# EAGLE design stereomix-front (EAGLE 9.0.1)
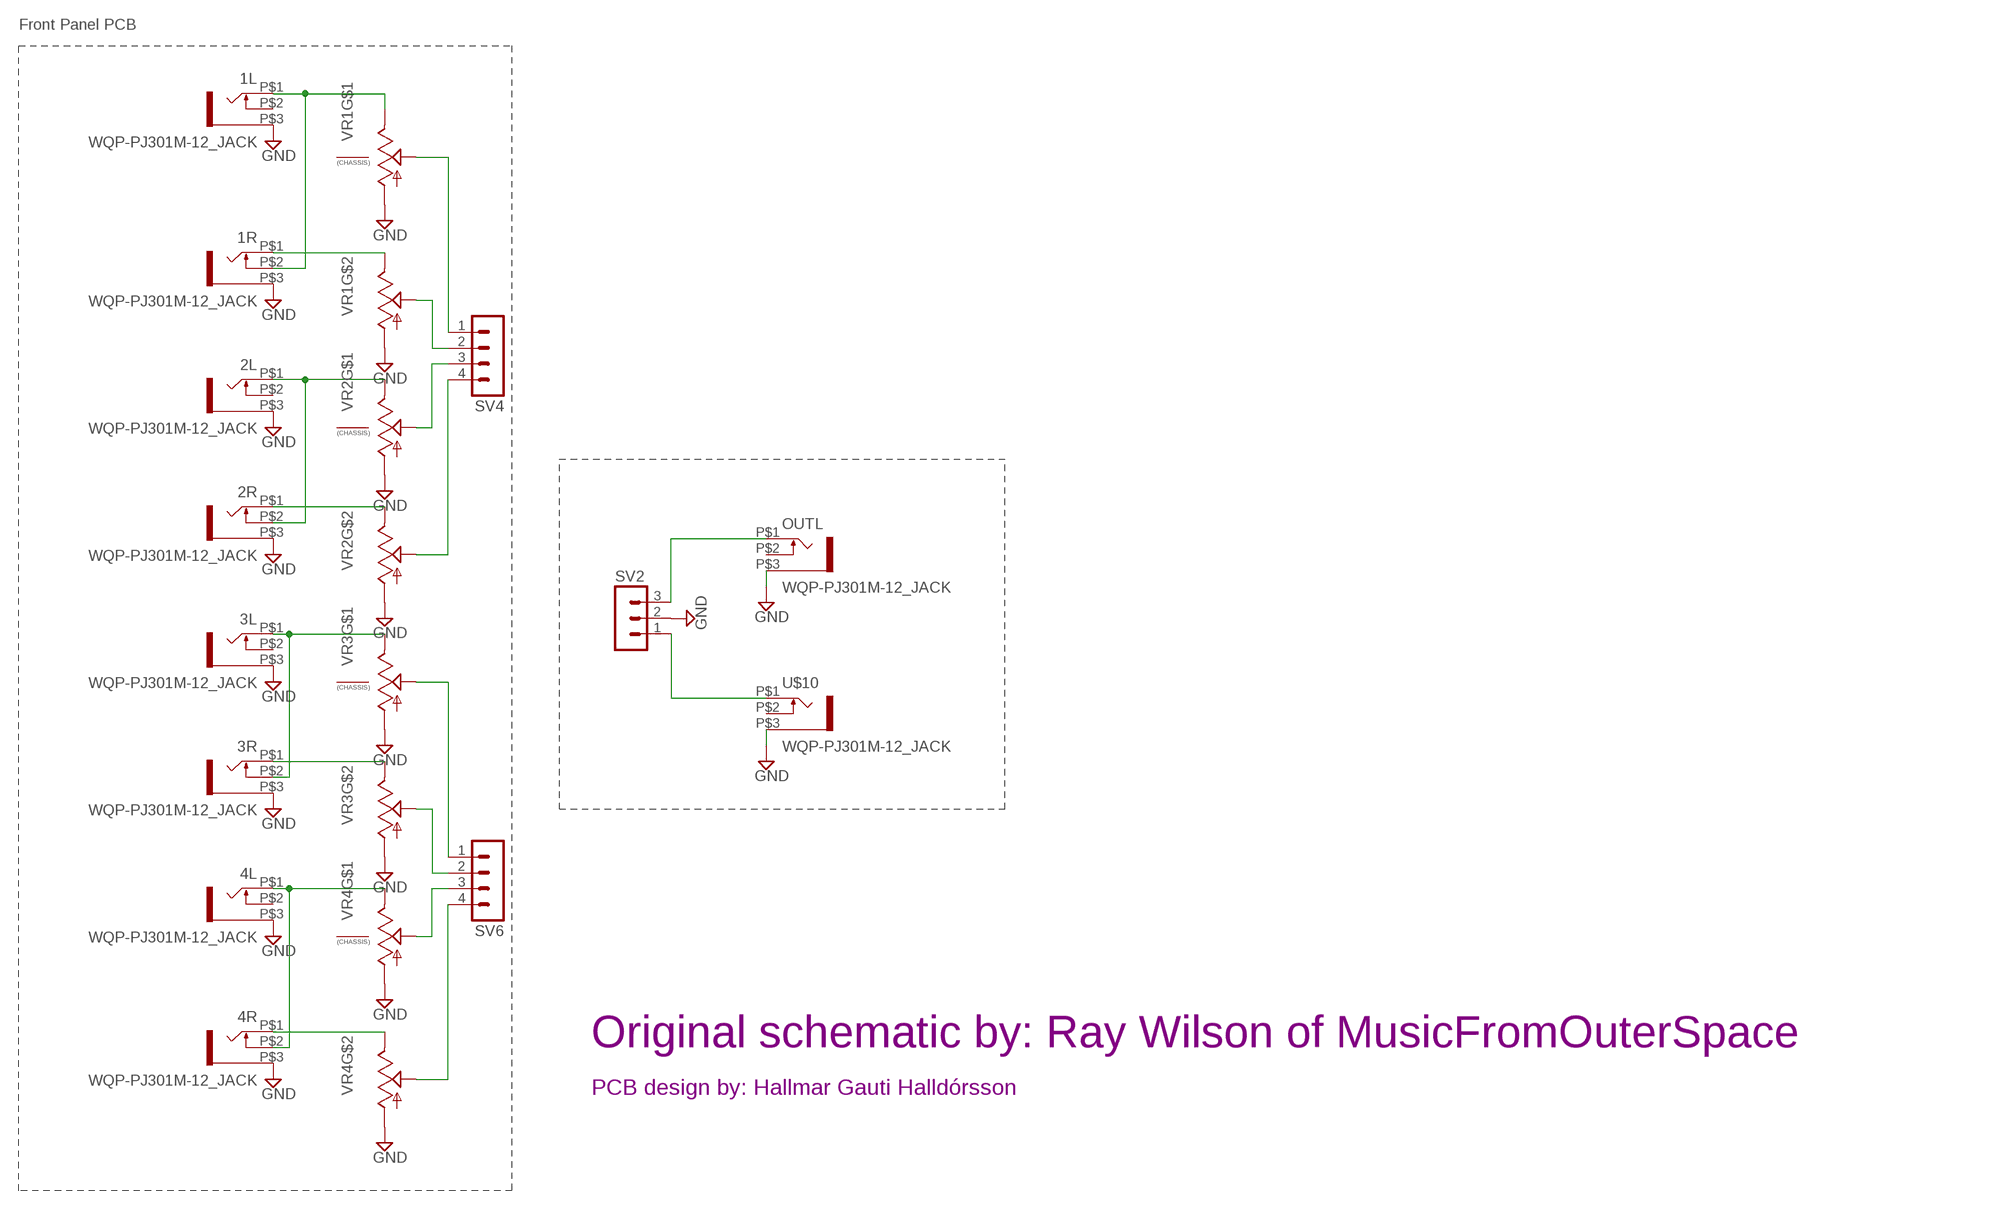
[diagram p0: schematic, sheet 1]

## Parts
1L  WQP-PJ301M-12_JACK  [WQP-PJ301M-12_JACK]
1R  WQP-PJ301M-12_JACK  [WQP-PJ301M-12_JACK]
2L  WQP-PJ301M-12_JACK  [WQP-PJ301M-12_JACK]
2R  WQP-PJ301M-12_JACK  [WQP-PJ301M-12_JACK]
3L  WQP-PJ301M-12_JACK  [WQP-PJ301M-12_JACK]
3R  WQP-PJ301M-12_JACK  [WQP-PJ301M-12_JACK]
4L  WQP-PJ301M-12_JACK  [WQP-PJ301M-12_JACK]
4R  WQP-PJ301M-12_JACK  [WQP-PJ301M-12_JACK]
OUTL  WQP-PJ301M-12_JACK  [WQP-PJ301M-12_JACK]
SV2  MA03-1  [MA03-1]
SV4  MA04-1  [MA04-1]
SV6  MA04-1  [MA04-1]
U$10  WQP-PJ301M-12_JACK  [WQP-PJ301M-12_JACK]
VR1  ALPHA-9MM-DUALPOT  [DUAL_9MM_SNAP-IN_POT]
VR2  ALPHA-9MM-DUALPOT  [DUAL_9MM_SNAP-IN_POT]
VR3  ALPHA-9MM-DUALPOT  [DUAL_9MM_SNAP-IN_POT]
VR4  ALPHA-9MM-DUALPOT  [DUAL_9MM_SNAP-IN_POT]

## Nets
GND: 1L.P$3 1R.P$3 2L.P$3 2R.P$3 3L.P$3 3R.P$3 4L.P$3 4R.P$3 OUTL.P$3 SV2.2 U$10.P$3 VR1.1(A) VR1.1B(A) VR2.1(A) VR2.1B(A) VR3.1(A) VR3.1B(A) VR4.1(A) VR4.1B(A)
N$17: SV4.1 VR1.2(S)
N$18: SV4.2 VR1.2B(S)
N$19: SV4.3 VR2.2(S)
N$20: SV4.4 VR2.2B(S)
N$21: SV6.1 VR3.2(S)
N$22: SV6.2 VR3.2B(S)
N$23: 1L.P$1 1R.P$2 VR1.3(E)
N$24: 1R.P$1 VR1.3B(E)
N$25: 2L.P$1 2R.P$2 VR2.3(E)
N$26: 2R.P$1 VR2.3B(E)
N$27: 3L.P$1 3R.P$2 VR3.3(E)
N$28: 3R.P$1 VR3.3B(E)
N$29: 4L.P$1 4R.P$2 VR4.3(E)
N$30: 4R.P$1 VR4.3B(E)
N$31: OUTL.P$1 SV2.3
N$32: SV2.1 U$10.P$1
N$33: SV6.3 VR4.2(S)
N$34: SV6.4 VR4.2B(S)
Unconnected: 1L.P$2 2L.P$2 3L.P$2 4L.P$2 OUTL.P$2 U$10.P$2 VR1.CHASSIS1 VR1.CHASSIS2 VR2.CHASSIS1 VR2.CHASSIS2 VR3.CHASSIS1 VR3.CHASSIS2 VR4.CHASSIS1 VR4.CHASSIS2

## Notes on the sheet
- Front Panel PCB
- Original schematic by: Ray Wilson of MusicFromOuterSpace
- PCB design by: Hallmar Gauti Halldórsson

## Library data of the parts
1L 1R 2L 2R 3L 3R 4L 4R OUTL U$10 = thonkiconn:WQP-PJ301M-12_JACK
SV2 = con-lstb:MA03-1: PIN HEADER; OC_FARNELL: unknown; OC_NEWARK: unknown
SV4 SV6 = con-lstb:MA04-1: PIN HEADER; OC_FARNELL: unknown; OC_NEWARK: unknown
VR1-VR4 = MusicThingModular:ALPHA-9MM-DUALPOT: 9mm vertical snap-in pot, Alpha / Panasonic style, with a connection to the metal chassis for grounding

## Board
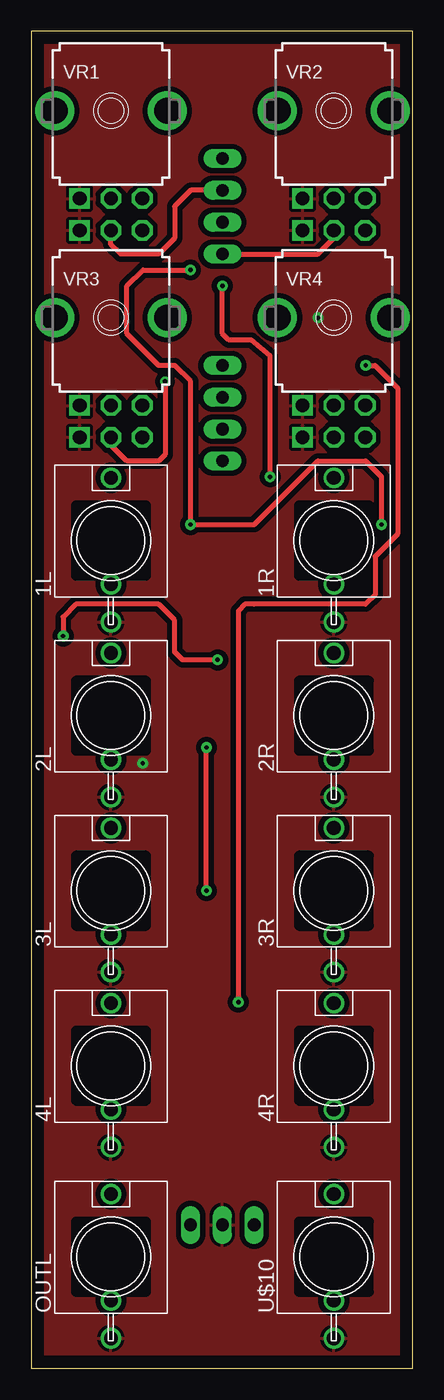
[diagram p1: board, top side]
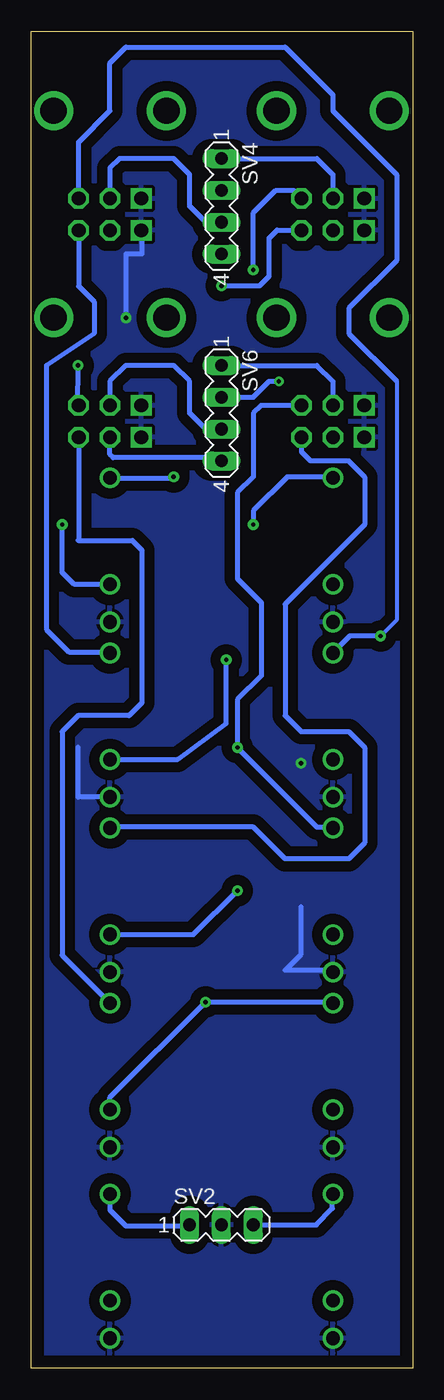
[diagram p2: board, bottom side, seen from below]

Size 30.4 x 106.67 mm. Coordinates in mm from the lower left corner, seen from the top.
Outline: 0,0 30.4,0 30.4,106.67 0,106.67 0,0
Copper layers (1*16): Top 0.035mm / dielectric 1.5mm / Bottom 0.035mm
Design rules "default": minimum track width 10mil, minimum drill 24mil, track to track 8mil, track to pad 8mil, pad to pad 8mil, via to via 8mil, smd to smd 8mil, copper to edge 40mil, drill to drill 8mil, minimum pad ring 10mil, minimum via ring 8mil, stop-mask expansion 4mil, vias tented up to drill 0mil, thermal gap 10mil

### Footprints (pad centres in the part's own frame; a part is rotated, then mirrored left to right if it is on the bottom)
WQP-PJ301M-12_JACK = drill 1.1: P$1 0,5; P$2 0,-3.5; P$3 0,-6.5
MA03-1 = drill 1.016 long: 1 -2.54,0; 2 0,0; 3 2.54,0
MA04-1 = drill 1.016 long: 1 -3.81,0; 2 -1.27,0; 3 1.27,0; 4 3.81,0
DUAL_9MM_SNAP-IN_POT = drill 1.1 square: 1 -2.5,-7; 1B -2.5,-9.54 | drill 1.1 octagon: 2 0,-7; 2B 0,-9.54; 3 2.5,-7; 3B 2.5,-9.54 | drill 2.1 pad 2.184: CHASSIS1 -4.5,0; CHASSIS2 4.5,0

### Placement (x,y rotation side)
1L  6.35,66.04 0 top
1R  24.13,66.04 0 top
2L  6.35,52.07 0 top
2R  24.13,52.07 0 top
3L  6.35,38.1 0 top
3R  24.13,38.1 0 top
4L  6.35,24.13 0 top
4R  24.13,24.13 0 top
OUTL  6.35,8.89 0 top
SV2  15.24,11.43 0 bottom
SV4  15.24,92.71 270 bottom
SV6  15.24,76.2 270 bottom
U$10  24.13,8.89 0 top
VR1  6.35,100.33 0 top
VR2  24.13,100.33 0 top
VR3  6.35,83.82 0 top
VR4  24.13,83.82 0 top

### Tracks (layer width: path | path; a pad name or v marks a point on that pad's centre or on a via)
GND  (via drill 0.35 pad 0.85)
  Bottom 0.406: 2R.P$3 26.67,45.57 26.67,49.53 | VR2.1B 21.59,90.79 21.59,88.9 22.86,88.9 v22.86,83.82 | 3L.P$3 6.5,31.75 10.16,31.75 8.89,33.02 8.89,36.83
  other vias: 8.89,48.26
  pour Bottom (isolate 0.813): 0,106.68 30.48,106.68 30.48,0 0,0
  pour Top (isolate 0.406): 0,106.68 30.48,106.68 30.48,0 0,0
N$17
  Bottom 0.406: SV4.1 7.62,96.52 6.35,95.25 VR1.2
N$18
  Top 0.406: SV4.2 12.7,93.98 11.43,92.71 11.43,90.17 10.16,88.9 7.11,88.9 6.35,89.66 VR1.2B
N$19
  Bottom 0.406: SV4.3 16.51,91.44 17.78,92.71 17.78,95.25 19.05,96.52 23.37,96.52 24.13,95.76 VR2.2
N$20
  Top 0.406: SV4.4 22.86,88.9 24.13,90.17 VR2.2B
  Bottom 0.406: SV4.4 16.51,88.9
N$21
  Bottom 0.406: SV6.1 7.62,80.01 6.35,78.74 VR3.2
N$22  (via drill 0.35)
  Top 0.406: v10.67,78.74 10.67,72.9 10.16,72.39 7.62,72.39 6.35,73.66 VR3.2B
  Bottom 0.406: SV6.2 12.7,77.47 11.43,78.74 v10.67,78.74
N$23  (via drill 0.35 pad 0.85)
  Top 0.406: v12.7,87.63 8.89,87.63 7.62,86.36 7.62,82.55 10.16,80.01 11.43,80.01 12.7,78.74 v12.7,67.31 17.78,67.31 22.86,72.39 26.67,72.39 27.94,71.12 v27.94,67.31
  Bottom 0.406: 1L.P$1 6.35,71.12 10,71.12 12.7,68.42 v12.7,67.31 | v12.7,87.63 12.7,92.18 10.9,93.98 9.5,93.98 VR1.3 | 1R.P$2 26.98,62.54 27.94,63.5 v27.94,67.31
N$24  (via drill 0.35 pad 0.85)
  Top 0.406: v19.05,71.12 19.05,80.77 17.53,82.04 15.75,82.04 15.24,82.55 v15.24,86.36
  Bottom 0.406: 1R.P$1 19.13,71.04 v19.05,71.12 | v15.24,86.36 12.19,86.36 11.43,87.12 11.43,90.17 10.79,90.81 8.87,90.81 VR1.3B
N$25  (via drill 0.35 pad 0.85)
  Top 0.406: v14.86,56.52 12.06,56.52 11.43,57.15 11.43,59.69 10.16,60.96 3.56,60.96 2.54,59.94 v2.54,58.42
  Bottom 0.305: 1.27,78.74 1.27,59.69 v2.54,58.42
  Bottom 0.406: VR2.3 26.63,97.83 24.13,100.33 24.13,104.14 22.86,105.41 10.16,105.41 6.35,101.6 6.35,100.33 1.27,95.25 1.27,88.37 5.08,84.56 5.08,82.55 1.27,78.74 | v2.54,58.42 5,58.42 2L.P$1 | 2R.P$2 18.74,48.57 14.86,51.44 v14.86,56.52
N$26
  Bottom 0.406: VR2.3B 26.63,86.32 25.4,85.09 25.4,82.55 29.21,80.01 29.21,58.95 27.41,57.15 24.21,57.15 2R.P$1
N$27  (via drill 0.35 pad 0.85)
  Top 0.406: v13.97,38.1 v13.97,49.53
  Bottom 0.406: VR3.3 12.08,76.82 12.7,76.2 12.7,71.12 13.97,69.85 13.97,62.99 13.21,62.23 12.06,61.09 12.06,55.24 13.97,53.34 v13.97,49.53 7.62,43.18 6.43,43.18 3L.P$1 | 3R.P$2 17.47,34.6 v13.97,38.1
N$28
  Bottom 0.406: 3R.P$1 24.05,43.18 12.7,43.18 10.16,40.64 5.08,40.64 3.81,41.91 3.81,49.53 5.08,50.8 8.89,50.8 10.16,52.07 10.16,60.96 3.81,67.31 3.81,71.12 5.08,72.39 8.13,72.39 8.85,73.11 VR3.3B
N$29  (via drill 0.35 pad 0.85)
  Top 0.406: v26.67,80.01 27.41,80.01 29.21,78.21 29.21,66.57 27.41,64.77 27.41,61.7 26.67,60.96 17.78,60.96 17.04,60.96 16.51,60.43 v16.51,29.21
  Bottom 0.406: VR4.3 26.68,76.82 v26.67,80.01 | 4L.P$1 6.43,29.21 v16.51,29.21 24.13,21.59 4R.P$2
N$30
  Bottom 0.406: VR4.3B 26.63,66.08 26.67,66.04 22.35,66.04 21.59,65.28 21.59,53.09 22.61,52.07 26.67,52.07 27.94,50.8 27.94,32.94 4R.P$1
N$31
  Bottom 0.406: SV2.3 7.66,11.43 6.39,12.74 6.43,13.97 OUTL.P$1
N$32
  Bottom 0.406: U$10.P$1 24.13,12.62 22.86,11.35 17.86,11.35 SV2.1
N$33
  Bottom 0.406: SV6.3 16.51,74.93 17.78,76.2 17.78,78.74 19.05,80.01 22.86,80.01 24.13,78.74 VR4.2
N$34
  Bottom 0.406: 16.38,72.52 16.51,72.39 SV6.4 15.49,72.64 23.88,72.64 24.13,72.9 VR4.2B